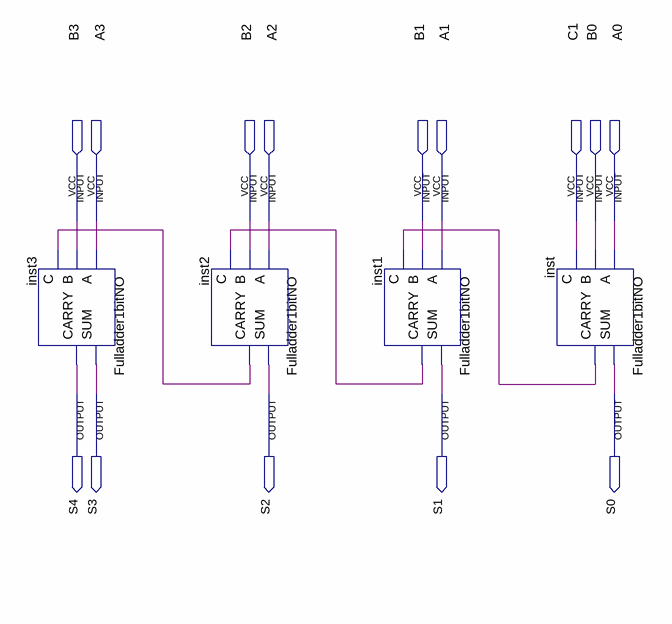
[diagram p0: schematic sheet]
// Quartus schematic Fulladder4bitNO.bdf as structural Verilog: 4 symbols, 14 pins
module Fulladder4bitNO (
  input  B3,
  input  A3,
  input  B2,
  input  A2,
  input  B1,
  input  A1,
  input  C1,
  input  B0,
  input  A0,
  output S4,
  output S3,
  output S2,
  output S1,
  output S0
);

  wire inst1_carry, inst2_carry, inst_carry;

  Fulladder1bitNO inst3 (.A(A3), .B(B3), .C(inst2_carry), .SUM(S3), .CARRY(S4));
  Fulladder1bitNO inst2 (.A(A2), .B(B2), .C(inst1_carry), .SUM(S2), .CARRY(inst2_carry));
  Fulladder1bitNO inst1 (.A(A1), .B(B1), .C(inst_carry), .SUM(S1), .CARRY(inst1_carry));
  Fulladder1bitNO inst (.A(A0), .B(B0), .C(C1), .SUM(S0), .CARRY(inst_carry));
endmodule
